# Altium project MB1801.PrjPCB (part 1 of 2)
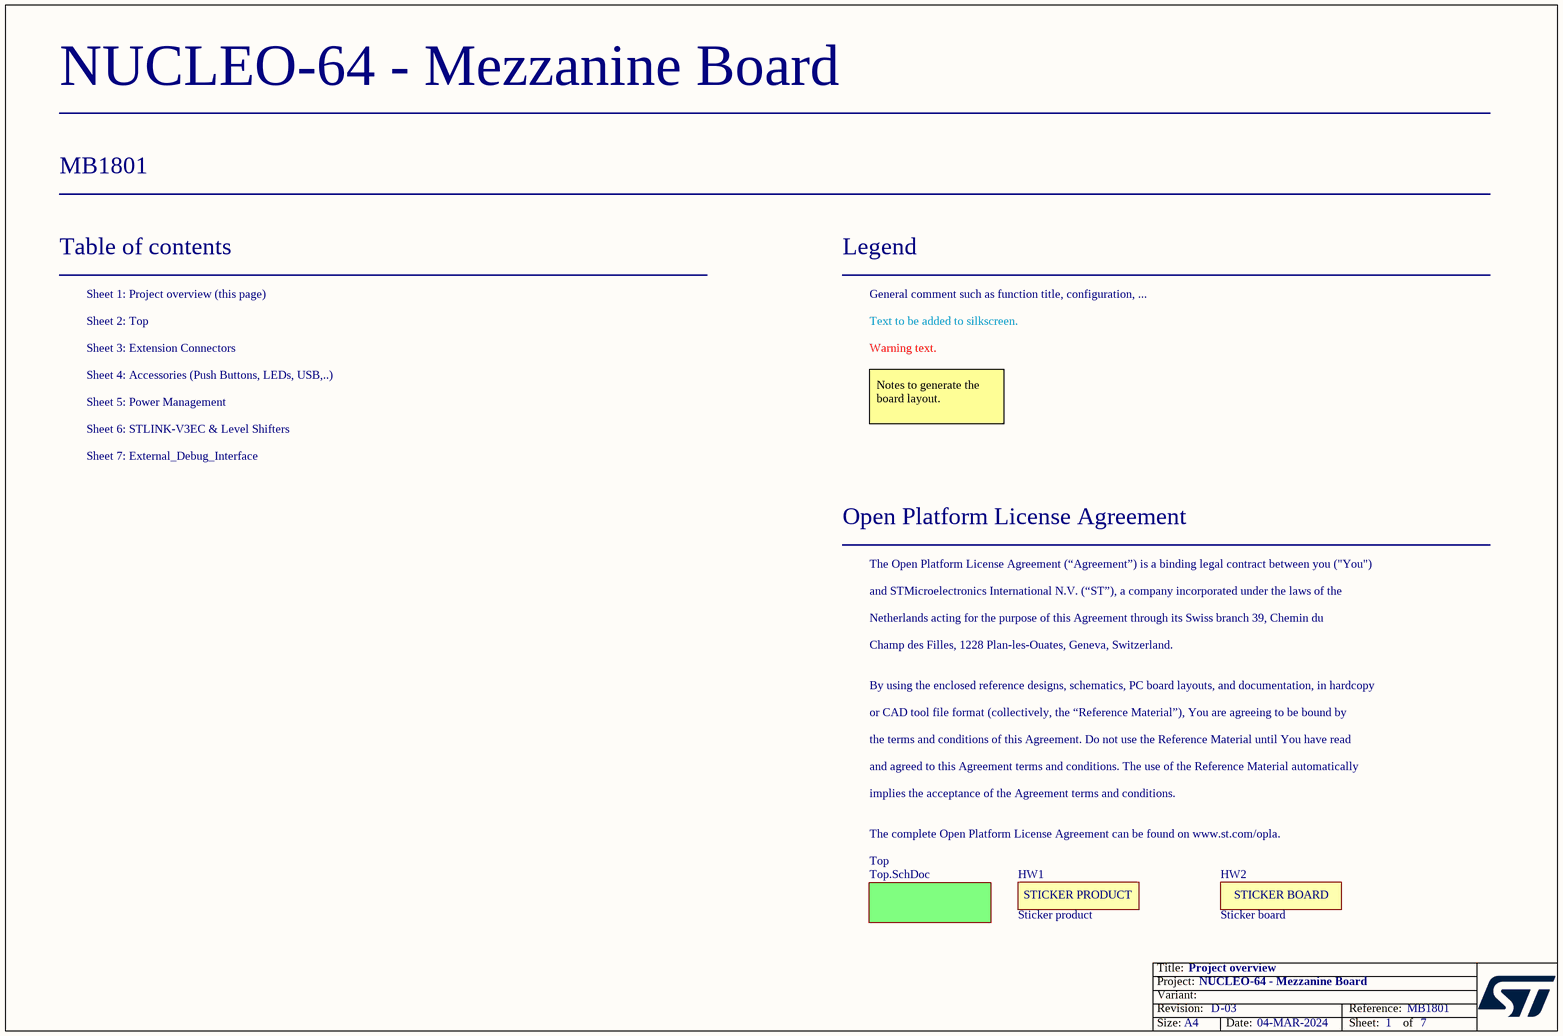
[diagram p0: Project_Overview.SchDoc]
Board_Reference: MB1801; Board_PCB_Revision: D; Board_Name: NUCLEO-64 - Mezzanine Board; Board_Document_Date: 04-MAR-2024; Board_Assembly_Revision: 03
7 sheets, 213 parts. Net scope: flat (ports and power ports of the same name join across sheets).
Board file: MB1801.PcbDoc
Sheets:
  Project_Overview.SchDoc
    Top = Top.SchDoc
      Extension Connectors = Extension_CN.SchDoc
      LEDs & Push Buttons & USB-C Connector = Accessories.SchDoc
      Power Management = Power_Management.SchDoc
      U_STlink-V3EC = STlink-V3EC.SchDoc
      U_External_Debug_Interface = External_Debug_Interface.SchDoc

## Sheet Project_Overview.SchDoc: Project overview
size A4; Date: Not used; ApprovedBy: Not used; CheckedBy: Not used; Author: Not used; CompanyName: STMicroelectronics; DrawnBy: Not used; Engineer: Not used; Organization: Not used; Address1: Not used; Address2: Not used; Address3: Not used; Address4: Not used; DocumentNumber: Not used; Revision: Not used; SheetNumber: 1; SheetTotal: 7; CurrentTime: Not used; CurrentDate: Not used; Time: Not used; DocumentFullPathAndName: Not used; DocumentName: Not used; ModifiedDate: Not used; ImagePath: Not used; ProjectName: Not used; Application_BuildNumber: Not used

### Parts
HW1  value Sticker product  [STICKER_PRODUCT_25X5]  (hidden comment: STICKER_PRODUCT)  (no BOM)
HW2  value Sticker board  [STICKER_BOARD_25X5]  (hidden comment: STICKER_BOARD)  (no BOM)

### Sub-sheets
Top = Top.SchDoc: no entries

### Notes on the sheet
- Table of contents
- Sheet 1: Project overview (this page)
- Legend
- General comment such as function title, configuration, ...
- Sheet 2: Top
- Sheet 3: Extension Connectors
- Sheet 4: Accessories (Push Buttons, LEDs, USB,..)
- Text to be added to silkscreen.
- Warning text.
- Sheet 6: STLINK-V3EC & Level Shifters
- Sheet 5: Power Management
- Notes to generate the board layout.
- Sheet 7: External_Debug_Interface
- Open Platform License Agreement
- The Open Platform License Agreement (“Agreement”) is a binding legal contract between you ("You")
- and STMicroelectronics International N.V. (“ST”), a company incorporated under the laws of the
- Netherlands acting for the purpose of this Agreement through its Swiss branch 39, Chemin du
- Champ des Filles, 1228 Plan-les-Ouates, Geneva, Switzerland.
- By using the enclosed reference designs, schematics, PC board layouts, and documentation, in hardcopy
- or CAD tool file format (collectively, the “Reference Material”), You are agreeing to be bound by
- the terms and conditions of this Agreement. Do not use the Reference Material until You have read
- and agreed to this Agreement terms and conditions. The use of the Reference Material automatically
- implies the acceptance of the Agreement terms and conditions.
- The complete Open Platform License Agreement can be found on www.st.com/opla.
- Title:
- Project:
- Size:
- Revision:
- Variant:
- A4
- -
- Date:
- Reference:
- Sheet:
- of
- (in symbol MCD-02189) STICKER PRODUCT
- (in symbol MCD-02190) STICKER BOARD

### Library data of the parts
HW1 = MCD-02189: Sticker product 25x5 mm; Part_Type: Misc; Part_Preference: Recommended; Component_Country_Of_Origin: Unknown; ShowFields: YES; ID: 4289; Internal_Part_Number: MCD-02189; Status: Released; Manufacturer: N/A; Manufacturer_Part_Number: N/A; ComponentLink1URL: N/A; Order_Code_Digikey: N/A; Order_Code_Farnell: N/A; Order_Code_RS: N/A
HW2 = MCD-02190: Sticker board 25x5 mm; Part_Type: Misc; Part_Preference: Recommended; Internal_Part_Number: MCD-02190; Status: Released; Manufacturer: N/A; Manufacturer_Part_Number: N/A; ComponentLink1URL: N/A; Order_Code_Digikey: N/A; Order_Code_Farnell: N/A; Order_Code_RS: N/A

## Sheet Top.SchDoc: Top Schematic
size A4; Date: Not used; ApprovedBy: Not used; CheckedBy: Not used; Author: Not used; CompanyName: STMicroelectronics; DrawnBy: Not used; Engineer: Not used; Organization: Not used; Address1: Not used; Address2: Not used; Address3: Not used; Address4: Not used; DocumentNumber: Not used; Revision: Not used; SheetNumber: 2; SheetTotal: 7; CurrentTime: Not used; CurrentDate: Not used; Time: Not used; DocumentFullPathAndName: Not used; DocumentName: Not used; ModifiedDate: Not used; ImagePath: Not used; ProjectName: Not used; Application_BuildNumber: Not used
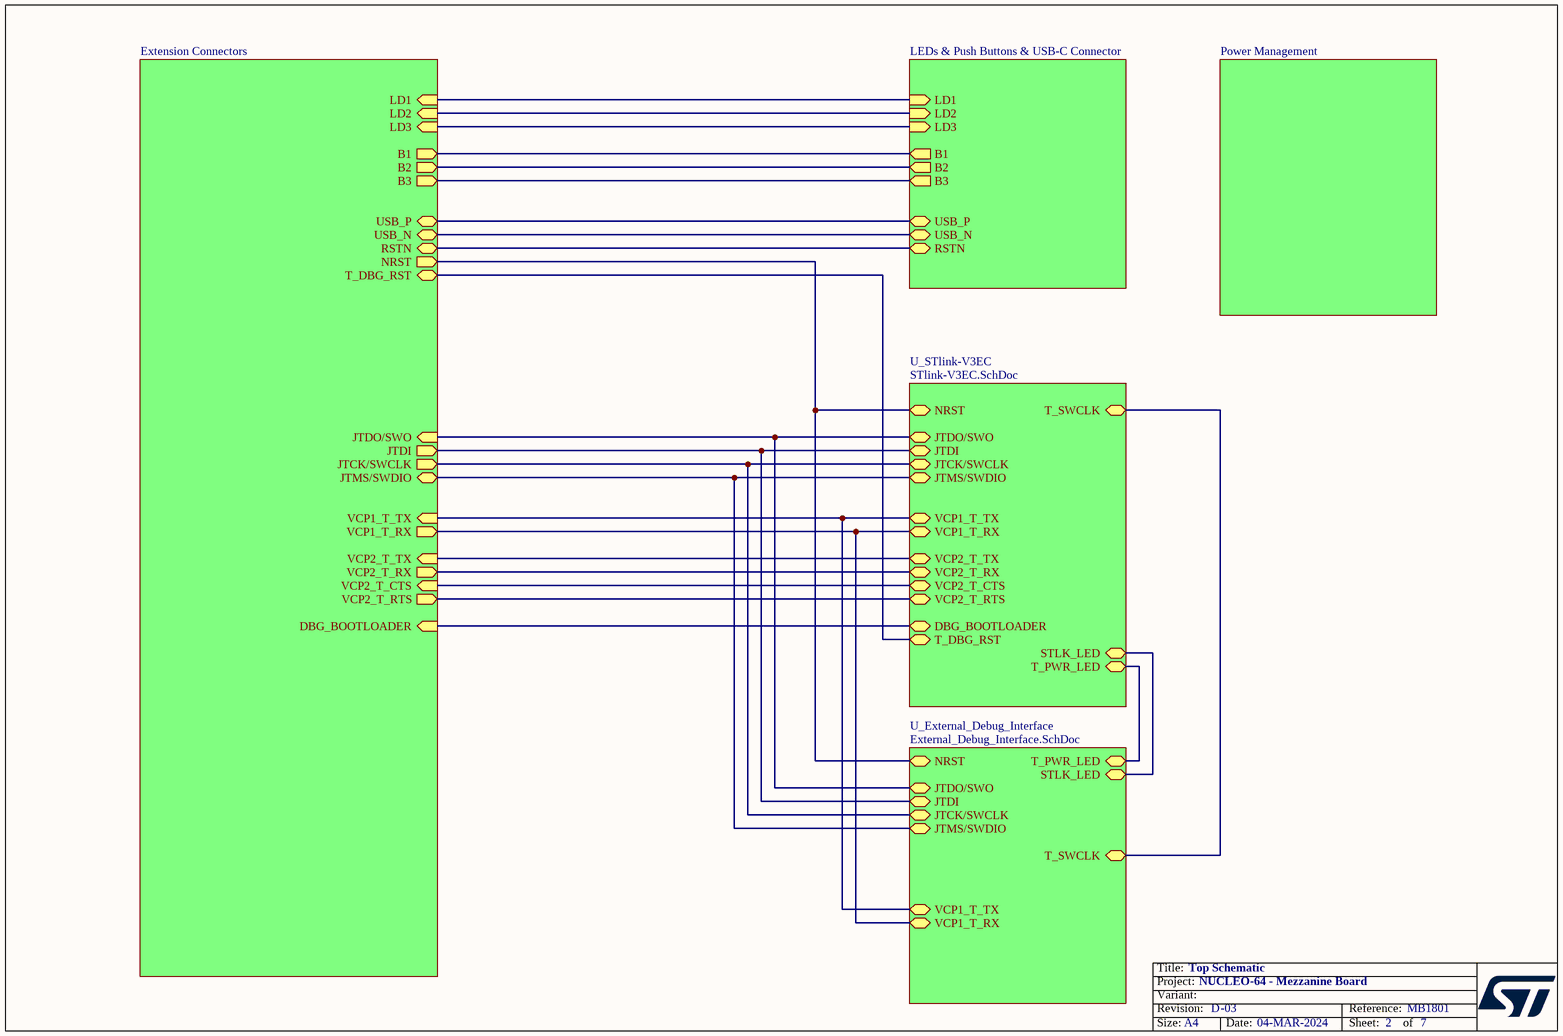
[diagram p1: Top.SchDoc]

### Sub-sheets
Extension Connectors = Extension_CN.SchDoc: JTMS/SWDIO (bidir), USB_P (bidir), USB_N (bidir), NRST (out), LD2 (in), LD3 (in), JTDI (out), B3 (out), B1 (out), JTDO/SWO (in), B2 (out), LD1 (in), DBG_BOOTLOADER (in), VCP1_T_RX (out), VCP2_T_CTS (in), VCP1_T_TX (in), VCP2_T_RX (out), VCP2_T_RTS (out), VCP2_T_TX (in), JTCK/SWCLK (out), T_DBG_RST (bidir), RSTN (bidir)
LEDs & Push Buttons & USB-C Connector = Accessories.SchDoc: LD1 (in), LD2 (in), LD3 (in), B1 (out), B2 (out), B3 (out), USB_P (bidir), USB_N (bidir), RSTN (bidir)
Power Management = Power_Management.SchDoc: no entries
U_External_Debug_Interface = External_Debug_Interface.SchDoc: JTDI (bidir), VCP1_T_TX (bidir), T_SWCLK (bidir), NRST (bidir), VCP1_T_RX (bidir), STLK_LED (bidir), T_PWR_LED (bidir), JTCK/SWCLK (bidir), JTMS/SWDIO (bidir), JTDO/SWO (bidir)
U_STlink-V3EC = STlink-V3EC.SchDoc: JTMS/SWDIO (bidir), JTDI (bidir), JTDO/SWO (bidir), NRST (bidir), DBG_BOOTLOADER (bidir), STLK_LED (bidir), VCP1_T_RX (bidir), VCP1_T_TX (bidir), T_PWR_LED (bidir), VCP2_T_RTS (bidir), VCP2_T_RX (bidir), VCP2_T_TX (bidir), T_SWCLK (bidir), VCP2_T_CTS (bidir), JTCK/SWCLK (bidir), T_DBG_RST (bidir)

### Nets
(unnamed): sheet Extension Connectors/JTMS/SWDIO, sheet U_STlink-V3EC/JTMS/SWDIO, sheet U_External_Debug_Interface/JTMS/SWDIO
(unnamed): sheet Extension Connectors/USB_P, sheet LEDs & Push Buttons & USB-C Connector/USB_P
(unnamed): sheet Extension Connectors/USB_N, sheet LEDs & Push Buttons & USB-C Connector/USB_N
(unnamed): sheet Extension Connectors/NRST, sheet U_STlink-V3EC/NRST, sheet U_External_Debug_Interface/NRST
(unnamed): sheet Extension Connectors/LD2, sheet LEDs & Push Buttons & USB-C Connector/LD2
(unnamed): sheet Extension Connectors/LD3, sheet LEDs & Push Buttons & USB-C Connector/LD3
(unnamed): sheet Extension Connectors/JTDI, sheet U_STlink-V3EC/JTDI, sheet U_External_Debug_Interface/JTDI
(unnamed): sheet Extension Connectors/B3, sheet LEDs & Push Buttons & USB-C Connector/B3
(unnamed): sheet Extension Connectors/B1, sheet LEDs & Push Buttons & USB-C Connector/B1
(unnamed): sheet Extension Connectors/JTDO/SWO, sheet U_STlink-V3EC/JTDO/SWO, sheet U_External_Debug_Interface/JTDO/SWO
(unnamed): sheet Extension Connectors/B2, sheet LEDs & Push Buttons & USB-C Connector/B2
(unnamed): sheet Extension Connectors/LD1, sheet LEDs & Push Buttons & USB-C Connector/LD1
(unnamed): sheet Extension Connectors/DBG_BOOTLOADER, sheet U_STlink-V3EC/DBG_BOOTLOADER
(unnamed): sheet Extension Connectors/VCP1_T_RX, sheet U_STlink-V3EC/VCP1_T_RX, sheet U_External_Debug_Interface/VCP1_T_RX
(unnamed): sheet Extension Connectors/VCP2_T_CTS, sheet U_STlink-V3EC/VCP2_T_CTS
(unnamed): sheet Extension Connectors/VCP1_T_TX, sheet U_STlink-V3EC/VCP1_T_TX, sheet U_External_Debug_Interface/VCP1_T_TX
(unnamed): sheet Extension Connectors/VCP2_T_RX, sheet U_STlink-V3EC/VCP2_T_RX
(unnamed): sheet Extension Connectors/VCP2_T_RTS, sheet U_STlink-V3EC/VCP2_T_RTS
(unnamed): sheet Extension Connectors/VCP2_T_TX, sheet U_STlink-V3EC/VCP2_T_TX
(unnamed): sheet Extension Connectors/JTCK/SWCLK, sheet U_STlink-V3EC/JTCK/SWCLK, sheet U_External_Debug_Interface/JTCK/SWCLK
(unnamed): sheet Extension Connectors/T_DBG_RST, sheet U_STlink-V3EC/T_DBG_RST
(unnamed): sheet Extension Connectors/RSTN, sheet LEDs & Push Buttons & USB-C Connector/RSTN
(unnamed): sheet U_STlink-V3EC/STLK_LED, sheet U_External_Debug_Interface/STLK_LED
(unnamed): sheet U_STlink-V3EC/T_PWR_LED, sheet U_External_Debug_Interface/T_PWR_LED
(unnamed): sheet U_STlink-V3EC/T_SWCLK, sheet U_External_Debug_Interface/T_SWCLK

### Notes on the sheet
- Title:
- Project:
- Size:
- Revision:
- Variant:
- A4
- -
- Date:
- Reference:
- Sheet:
- of

## Sheet Extension_CN.SchDoc: Extension Connectors
size A4; Date: Not used; ApprovedBy: Not used; CheckedBy: Not used; Author: Not used; CompanyName: STMicroelectronics; DrawnBy: Not used; Engineer: Not used; Organization: Not used; Address1: Not used; Address2: Not used; Address3: Not used; Address4: Not used; DocumentNumber: Not used; Revision: Not used; SheetNumber: 3; SheetTotal: 7; CurrentTime: Not used; CurrentDate: Not used; Time: Not used; DocumentFullPathAndName: Not used; DocumentName: Not used; ModifiedDate: Not used; ImagePath: Not used; ProjectName: Not used; Application_BuildNumber: Not used
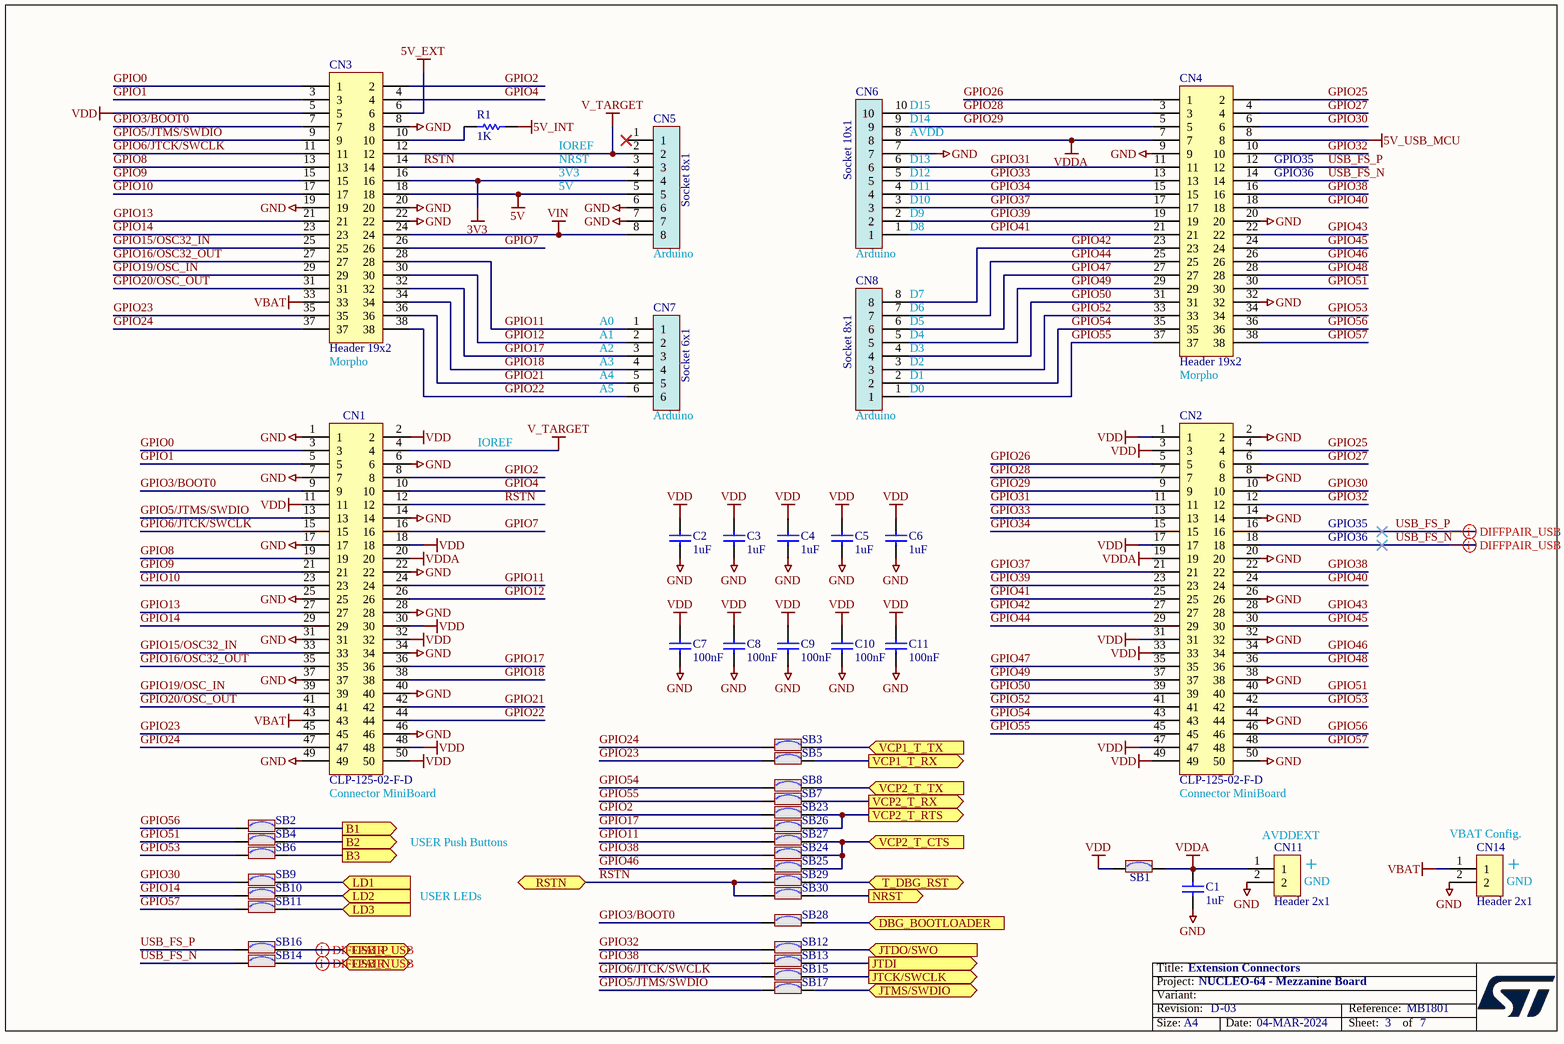
[diagram p2: Extension_CN.SchDoc]

### Parts
C1  value 1uF  [C0805_H0P85]  (hidden comment: Capacitor)
C2  value 1uF  [C0805_H0P85]  (hidden comment: Capacitor)
C3  value 1uF  [C0805_H0P85]  (hidden comment: Capacitor)
C4  value 1uF  [C0805_H0P85]  (hidden comment: Capacitor)
C5  value 1uF  [C0805_H0P85]  (hidden comment: Capacitor)
C6  value 1uF  [C0805_H0P85]  (hidden comment: Capacitor)
C7  value 100nF  [C0402]  (hidden comment: Capacitor)
C8  value 100nF  [C0402]  (hidden comment: Capacitor)
C9  value 100nF  [C0402]  (hidden comment: Capacitor)
C10  value 100nF  [C0402]  (hidden comment: Capacitor)
C11  value 100nF  [C0402]  (hidden comment: Capacitor)
CN1  CLP-125-02-F-D  [CON_SAMTEC_CLP-125-02-F-D]
CN2  CLP-125-02-F-D  [CON_SAMTEC_CLP-125-02-F-D]
CN3  Header 19x2  [CON_SAMTEC_TSW-119-09-X-D]
CN4  Header 19x2  [CON_SAMTEC_TSW-119-09-X-D]
CN5  Socket 8x1  [CON_SAMTEC_SSW-108-01-X-S]
CN6  Socket 10x1  [CON_SAMTEC_SSW-110-01-X-S]
CN7  Socket 6x1  [CON_SAMTEC_SSW-106-01-X-S]
CN8  Socket 8x1  [CON_SAMTEC_SSW-108-01-X-S]
CN11  Header 2x1  [CON_SAMTEC_TSW-102-07-G-S]
CN14  Header 2x1  [CON_SAMTEC_TSW-102-07-G-S]
R1  value 1K  [R0402]  (hidden comment: Resistor)
SB1  SB_ON  [SOLDER-BRIDGE_R0402-0R]  (value not drawn)
SB2  SB_ON  [SOLDER-BRIDGE_R0402-0R]  (value not drawn)
SB3  SB_ON  [SOLDER-BRIDGE_R0402-0R]  (value not drawn)
SB4  SB_ON  [SOLDER-BRIDGE_R0402-0R]  (value not drawn)
SB5  SB_ON  [SOLDER-BRIDGE_R0402-0R]  (value not drawn)
SB6  SB_ON  [SOLDER-BRIDGE_R0402-0R]  (value not drawn)
SB7  SB_ON  [SOLDER-BRIDGE_R0402-0R]  (value not drawn)
SB8  SB_ON  [SOLDER-BRIDGE_R0402-0R]  (value not drawn)
SB9  SB_ON  [SOLDER-BRIDGE_R0402-0R]  (value not drawn)
SB10  SB_ON  [SOLDER-BRIDGE_R0402-0R]  (value not drawn)
SB11  SB_ON  [SOLDER-BRIDGE_R0402-0R]  (value not drawn)
SB12  SB_ON  [SOLDER-BRIDGE_R0402-0R]  (value not drawn)
SB13  SB_ON  [SOLDER-BRIDGE_R0402-0R]  (value not drawn)
SB14  SB_ON  [SOLDER-BRIDGE_R0402-0R]  (value not drawn)
SB15  SB_ON  [SOLDER-BRIDGE_R0402-0R]  (value not drawn)
SB16  SB_ON  [SOLDER-BRIDGE_R0402-0R]  (value not drawn)
SB17  SB_ON  [SOLDER-BRIDGE_R0402-0R]  (value not drawn)
SB23  SB_ON  [SOLDER-BRIDGE_R0402-0R]  (value not drawn)
SB24  SB_ON  [SOLDER-BRIDGE_R0402-0R]  (value not drawn)
SB25  SB_ON  [SOLDER-BRIDGE_R0402-0R]  (value not drawn)
SB26  SB_ON  [SOLDER-BRIDGE_R0402-0R]  (value not drawn)
SB27  SB_ON  [SOLDER-BRIDGE_R0402-0R]  (value not drawn)
SB28  SB_ON  [SOLDER-BRIDGE_R0402-0R]  (value not drawn)
SB29  SB_ON  [SOLDER-BRIDGE_R0402-0R]  (value not drawn)
SB30  SB_ON  [SOLDER-BRIDGE_R0402-0R]  (value not drawn)

### Ports
B1 (out), B2 (out), B3 (out), DBG_BOOTLOADER (in), JTCK/SWCLK (out), JTDI (out), JTDO/SWO (in), JTMS/SWDIO (bidir), LD1 (in), LD2 (in), LD3 (in), NRST (out), RSTN (bidir), T_DBG_RST (bidir), USB_N (bidir), USB_P (bidir), VCP1_T_RX (out), VCP1_T_TX (in), VCP2_T_CTS (in), VCP2_T_RTS (out), VCP2_T_RX (out), VCP2_T_TX (in)

### Nets
3V3: CN3.16 CN5.4
5V: CN3.18 CN5.5
5V_EXT: CN3.6
5V_INT: R1.2
5V_USB_MCU: CN4.8
GND: C1.1 C2.1 C3.1 C4.1 C5.1 C6.1 C7.1 C8.1 C9.1 C10.1 C11.1 CN1.1 CN1.6 CN1.7 CN1.14 CN1.17 CN1.22 CN1.25 CN1.28 CN1.31 CN1.34 CN1.37 CN1.40 CN1.46 CN1.49 CN2.2 CN2.8 CN2.14 CN2.20 CN2.26 CN2.32 CN2.38 CN2.44 CN2.50 CN3.8 CN3.19 CN3.20 CN3.22 CN4.9 CN4.20 CN4.32 CN5.6 CN5.7 CN6.7 CN11.2 CN14.2
V_TARGET: CN1.4 CN3.12 CN5.2
VBAT: CN1.43 CN3.33 CN14.1
VDD: C2.2 C3.2 C4.2 C5.2 C6.2 C7.2 C8.2 C9.2 C10.2 C11.2 CN1.2 CN1.11 CN1.18 CN1.30 CN1.32 CN1.48 CN1.50 CN2.1 CN2.3 CN2.17 CN2.31 CN2.33 CN2.47 CN2.49 CN3.5 SB1.1
VDDA: C1.2 CN1.20 CN2.19 CN4.7 CN6.8 CN11.1 SB1.2
VIN: CN3.24 CN5.8
B1: SB2.2 ; port B1
B2: SB4.2 ; port B2
B3: SB6.2 ; port B3
DBG_BOOTLOADER: SB28.2 ; port DBG_BOOTLOADER
GPIO0: CN1.3 CN3.1
GPIO1: CN1.5 CN3.3
GPIO2: CN1.8 CN3.2 SB23.1
GPIO3/BOOT0: CN1.9 CN3.7 SB28.1
GPIO4: CN1.10 CN3.4
GPIO5/JTMS/SWDIO: CN1.13 CN3.9 SB17.1
GPIO6/JTCK/SWCLK: CN1.15 CN3.11 SB15.1
GPIO7: CN1.16 CN3.26
GPIO8: CN1.19 CN3.13
GPIO9: CN1.21 CN3.15
GPIO10: CN1.23 CN3.17
GPIO11: CN1.24 CN3.28 CN7.1 SB27.1
GPIO12: CN1.26 CN3.30 CN7.2
GPIO13: CN1.27 CN3.21
GPIO14: CN1.29 CN3.23 SB10.1
GPIO15/OSC32_IN: CN1.33 CN3.25
GPIO16/OSC32_OUT: CN1.35 CN3.27
GPIO17: CN1.36 CN3.32 CN7.3 SB26.1
GPIO18: CN1.38 CN3.34 CN7.4
GPIO19/OSC_IN: CN1.39 CN3.29
GPIO20/OSC_OUT: CN1.41 CN3.31
GPIO21: CN1.42 CN3.36 CN7.5
GPIO22: CN1.44 CN3.38 CN7.6
GPIO23: CN1.45 CN3.35 SB5.1
GPIO24: CN1.47 CN3.37 SB3.1
GPIO25: CN2.4 CN4.2
GPIO26: CN2.5 CN4.1
GPIO27: CN2.6 CN4.4
GPIO28: CN2.7 CN4.3 CN6.10
GPIO29: CN2.9 CN4.5 CN6.9
GPIO30: CN2.10 CN4.6 SB9.1
GPIO31: CN2.11 CN4.11 CN6.6
GPIO32: CN2.12 CN4.10 SB12.1
GPIO33: CN2.13 CN4.13 CN6.5
GPIO34: CN2.15 CN4.15 CN6.4
GPIO37: CN2.21 CN4.17 CN6.3
GPIO38: CN2.22 CN4.16 SB13.1 SB24.1
GPIO39: CN2.23 CN4.19 CN6.2
GPIO40: CN2.24 CN4.18
GPIO41: CN2.25 CN4.21 CN6.1
GPIO42: CN2.27 CN4.23 CN8.8
GPIO43: CN2.28 CN4.22
GPIO44: CN2.29 CN4.25 CN8.7
GPIO45: CN2.30 CN4.24
GPIO46: CN2.34 CN4.26 SB25.1
GPIO47: CN2.35 CN4.27 CN8.6
GPIO48: CN2.36 CN4.28
GPIO49: CN2.37 CN4.29 CN8.5
GPIO50: CN2.39 CN4.31 CN8.4
GPIO51: CN2.40 CN4.30 SB4.1
GPIO52: CN2.41 CN4.33 CN8.3
GPIO53: CN2.42 CN4.34 SB6.1
GPIO54: CN2.43 CN4.35 CN8.2 SB8.1
GPIO55: CN2.45 CN4.37 CN8.1 SB7.1
GPIO56: CN2.46 CN4.36 SB2.1
GPIO57: CN2.48 CN4.38 SB11.1
JTCK/SWCLK: SB15.2 ; port JTCK/SWCLK
JTDI: SB13.2 ; port JTDI
JTDO/SWO: SB12.2 ; port JTDO/SWO
JTMS/SWDIO: SB17.2 ; port JTMS/SWDIO
LD1: SB9.2 ; port LD1
LD2: SB10.2 ; port LD2
LD3: SB11.2 ; port LD3
NRST: SB30.2 ; port NRST
RSTN: CN1.12 CN3.14 CN5.3 SB29.1 SB30.1 ; port RSTN
T_DBG_RST: SB29.2 ; port T_DBG_RST
USB_FS_N: CN2.18 CN4.14 SB14.1
USB_FS_P: CN2.16 CN4.12 SB16.1
USB_N: SB14.2 ; port USB_N
USB_P: SB16.2 ; port USB_P
VCP1_T_RX: SB5.2 ; port VCP1_T_RX
VCP1_T_TX: SB3.2 ; port VCP1_T_TX
VCP2_T_CTS: SB24.2 SB25.2 SB27.2 ; port VCP2_T_CTS
VCP2_T_RTS: SB23.2 SB26.2 ; port VCP2_T_RTS
VCP2_T_RX: SB7.2 ; port VCP2_T_RX
VCP2_T_TX: SB8.2 ; port VCP2_T_TX
NetCN3_10: CN3.10 R1.1

Not connected (* = marked no-connect by the designer): CN5 1*

### Layout directives
differential pair; rule Impedance Constraint [Min = 85.00    Max = 95.00    ]: USB_FS_N, USB_FS_P, USB_N, USB_P

### Notes on the sheet
- (near CN6) D15
- IOREF
- NRST
- 3V3
- (near CN6) D12
- (near CN6) D13
- (near CN6) D14
- (near CN6) AVDD
- (near CN4) GPIO35
- (near CN4) GPIO36
- 5V
- (near CN6) D8
- (near CN6) D9
- (near CN6) D10
- (near CN6) D11
- (near CN5) Arduino
- (near CN6) Arduino
- (near CN8) D6
- (near CN8) D7
- (near CN3) Morpho
- (near CN7) A0
- (near CN7) A1
- (near CN7) A2
- (near CN7) A3
- (near CN7) A4
- (near CN8) D1
- (near CN8) D2
- (near CN8) D3
- (near CN8) D4
- (near CN8) D5
- (near CN4) Morpho
- (near CN7) A5
- (near CN7) Arduino
- (near CN8) Arduino
- (near CN8) D0
- GPIO35
- GPIO36
- (near CN1) Connector MiniBoard
- USER Push Buttons
- (near CN2) Connector MiniBoard
- (near CN11) AVDDEXT
- (near CN14) VBAT Config.
- USER LEDs
- (near CN11) GND
- (near CN11) +
- (near CN14) GND
- (near CN14) +
- Title:
- Project:
- Size:
- Revision:
- Variant:
- -
- Date:
- Reference:
- Sheet:
- of

### Library data of the parts
C1-C6 = MCD-01550: Capacitor, MLCC, 1uF, 16V, X5R, +/-10%, 0805, T=0.85mm; Manufacturer_Part_Number: CC0805KRX5R7BB105; Manufacturer: YAGEO; Part_Preference: Recommended; Component_Country_Of_Origin: China; Internal_Part_Number: MCD-01550; Status: Released; Part_Type: Capacitor; Package: 0805; ComponentLink1URL: http://tunmcdsvn.tun.st.com/Component_Documentation_Library/Trunk/Capacitor/YAGEO_X5R_Series; Order_Code_Digikey: 311-3427-1-ND; Order_Code_Farnell: N/A; Order_Code_RS: N/A
C7-C11 = MCD-02355: Capacitor, MLCC, 100nF, 25V, X7R, +/-10%, 0402, T=0.5mm; Part_Preference: Recommended; Manufacturer: WALSIN; Manufacturer_Part_Number: 0402B104K250CT; Order_Code_RS: 176-3114; Component_Country_Of_Origin: Unknown; Internal_Part_Number: MCD-02355; Status: Checked; Part_Type: Capacitor; Package: 0402; ComponentLink1URL: http://tunmcdsvn.tun.st.com/Component_Documentation_Library/Trunk/Capacitor/WALSIN_Monolithic_Series/; Order_Code_Digikey: 1292-1175-1-ND; Order_Code_Farnell: 2496772
CN1 CN2 = MCD-02705: Socket, 25x2, 1.27mm, VR, SMD, T=2.29mm; Part_Type: Connector; Part_Preference: Recommended; Manufacturer: SAMTEC; Value: Socket 25x2; Order_Code_RS: 180-3642; Component_Country_Of_Origin: USA; ShowFields: YES; ID: 4811; Order_Code_Digikey: SAM1153-25-ND; Order_Code_Farnell: 2779411; Status: Checked; ComponentLink1URL: http://tunmcdsvn.tun.st.com/Component_Documentation_Library/Trunk/Connector/SAMTEC_CLP_Series; Internal_Part_Number: MCD-02705; Manufacturer_Part_Number: CLP-125-02-F-D
CN3 CN4 = MCD-00213: Header, 19x2, 2.54mm, VR, TH, T=5.84mm/10.16mm; Part_Type: Connector; Part_Preference: Recommended; Manufacturer: SAMTEC; Manufacturer_Part_Number: TSW-119-09-G-D; Component_Country_Of_Origin: China, Costa Rica, Malaysia, United States, Vietnam; Internal_Part_Number: MCD-00213; Value: Header 19x2; Status: Released; ComponentLink1URL: http://tunmcdsvn.tun.st.com/Component_Documentation_Library/Trunk/Connector/SAMTEC_TSW_Series/; Order_Code_Digikey: TSW-119-09-G-D-ND; Order_Code_Farnell: 3664236; Order_Code_RS: N/A
CN5 CN8 = MCD-01743: Socket, 8x1, 2.54mm, VR, TH, T=8.51/2.64mm; Part_Type: Connector; Part_Preference: Recommended; Manufacturer: SAMTEC; Manufacturer_Part_Number: SSW-108-01-G-S; Order_Code_RS: 765-5698; Component_Country_Of_Origin: China, Costa Rica, Malaysia, United States, Vietnam; Internal_Part_Number: MCD-01743; Value: Socket 8x1; Status: Released; ComponentLink1URL: http://tunmcdsvn.tun.st.com/Component_Documentation_Library/Trunk/Connector/SAMTEC_SSW-SSQ(TH)_Series/; Order_Code_Digikey: SAM1209-08-ND; Order_Code_Farnell: 1668363
CN6 = MCD-02080: Socket, 10x1, 2.54mm, VR, TH, T=8.51/2.64mm; Part_Type: Connector; Part_Preference: Recommended; Manufacturer: SAMTEC; Manufacturer_Part_Number: SSW-110-01-G-S; Order_Code_RS: 765-5736; Component_Country_Of_Origin: China, Costa Rica, Malaysia, United States, Vietnam; Internal_Part_Number: MCD-02080; Value: Socket 10x1; Status: Checked; ComponentLink1URL: http://tunmcdsvn.tun.st.com/Component_Documentation_Library/Trunk/Connector/SAMTEC_SSW-SSQ(TH)_Series/; Order_Code_Digikey: SSW-110-01-G-S-LL-ND; Order_Code_Farnell: 1668374
CN7 = MCD-02079: Socket, 6x1, 2.54mm, VR, TH, T=8.51/2.64mm; Part_Type: Connector; Part_Preference: Recommended; Manufacturer: SAMTEC; Manufacturer_Part_Number: SSW-106-01-G-S; Order_Code_RS: 765-5666; Component_Country_Of_Origin: China, Costa Rica, Malaysia, United States, Vietnam; Internal_Part_Number: MCD-02079; Value: Socket 6x1; Status: Checked; ComponentLink1URL: http://tunmcdsvn.tun.st.com/Component_Documentation_Library/Trunk/Connector/SAMTEC_SSW-SSQ(TH)_Series/; Order_Code_Digikey: SSW-106-01-G-S-LL-ND; Order_Code_Farnell: 1668352
CN11 CN14 = MCD-00032: Header, 2x1, 2.54mm, VR, TH, T=5.84mm/2.54mm; Part_Type: Connector; Part_Preference: Recommended; Manufacturer: SAMTEC; Manufacturer_Part_Number: TSW-102-07-G-S; Order_Code_RS: 155-5312; Component_Country_Of_Origin: China, Costa Rica, Malaysia, United States, Vietnam; Internal_Part_Number: MCD-00032; Value: Header 2x1; Status: Released; ComponentLink1URL: http://tunmcdsvn.tun.st.com/Component_Documentation_Library/Trunk/Connector/SAMTEC_TSW_Series/; Order_Code_Digikey: SAM1029-02-ND; Order_Code_Farnell: 2505044
R1 = MCD-00061: Resistor, 1K, 0402, +/-1%,1/16W; Part_Preference: Recommended; Manufacturer: YAGEO; Manufacturer_Part_Number: RC0402FR-071KL; Component_Country_Of_Origin: China; Internal_Part_Number: MCD-00061; Status: Released; Part_Type: Resistor; Package: 0402; ComponentLink1URL: http://tunmcdsvn.tun.st.com/Component_Documentation_Library/Trunk/Resistor/YAGEO_RC_L_Series; Order_Code_Digikey: 311-1.00KLRCT-ND; Order_Code_Farnell: 9239235; Order_Code_RS: N/A
SB1-SB17 SB23-SB30 = MCD-01618: Solder Bridge 0402 ON; Part_Type: Misc; Part_Preference: Recommended; Manufacturer: YAGEO; Manufacturer_Part_Number: RC0402JR-070RL; Order_Code_RS: 618-5804; Component_Country_Of_Origin: China; Internal_Part_Number: MCD-01618; Status: Released; Package: SB0402; ComponentLink1URL: http://tunmcdsvn.tun.st.com/Component_Datasheet_Library/Trunk/Resistors/Yageo_Resistor_RC0402-series; Order_Code_Digikey: 311-0.0JRTR-ND; Order_Code_Farnell: 2363467

## Sheet Accessories.SchDoc: LEDs & Push Buttons & USB-C Connector
size A4; Date: Not used; ApprovedBy: Not used; CheckedBy: Not used; Author: Not used; CompanyName: STMicroelectronics; DrawnBy: Not used; Engineer: Not used; Organization: Not used; Address1: Not used; Address2: Not used; Address3: Not used; Address4: Not used; DocumentNumber: Not used; Revision: Not used; SheetNumber: 4; SheetTotal: 7; CurrentTime: Not used; CurrentDate: Not used; Time: Not used; DocumentFullPathAndName: Not used; DocumentName: Not used; ModifiedDate: Not used; ImagePath: Not used; ProjectName: Not used; Application_BuildNumber: Not used
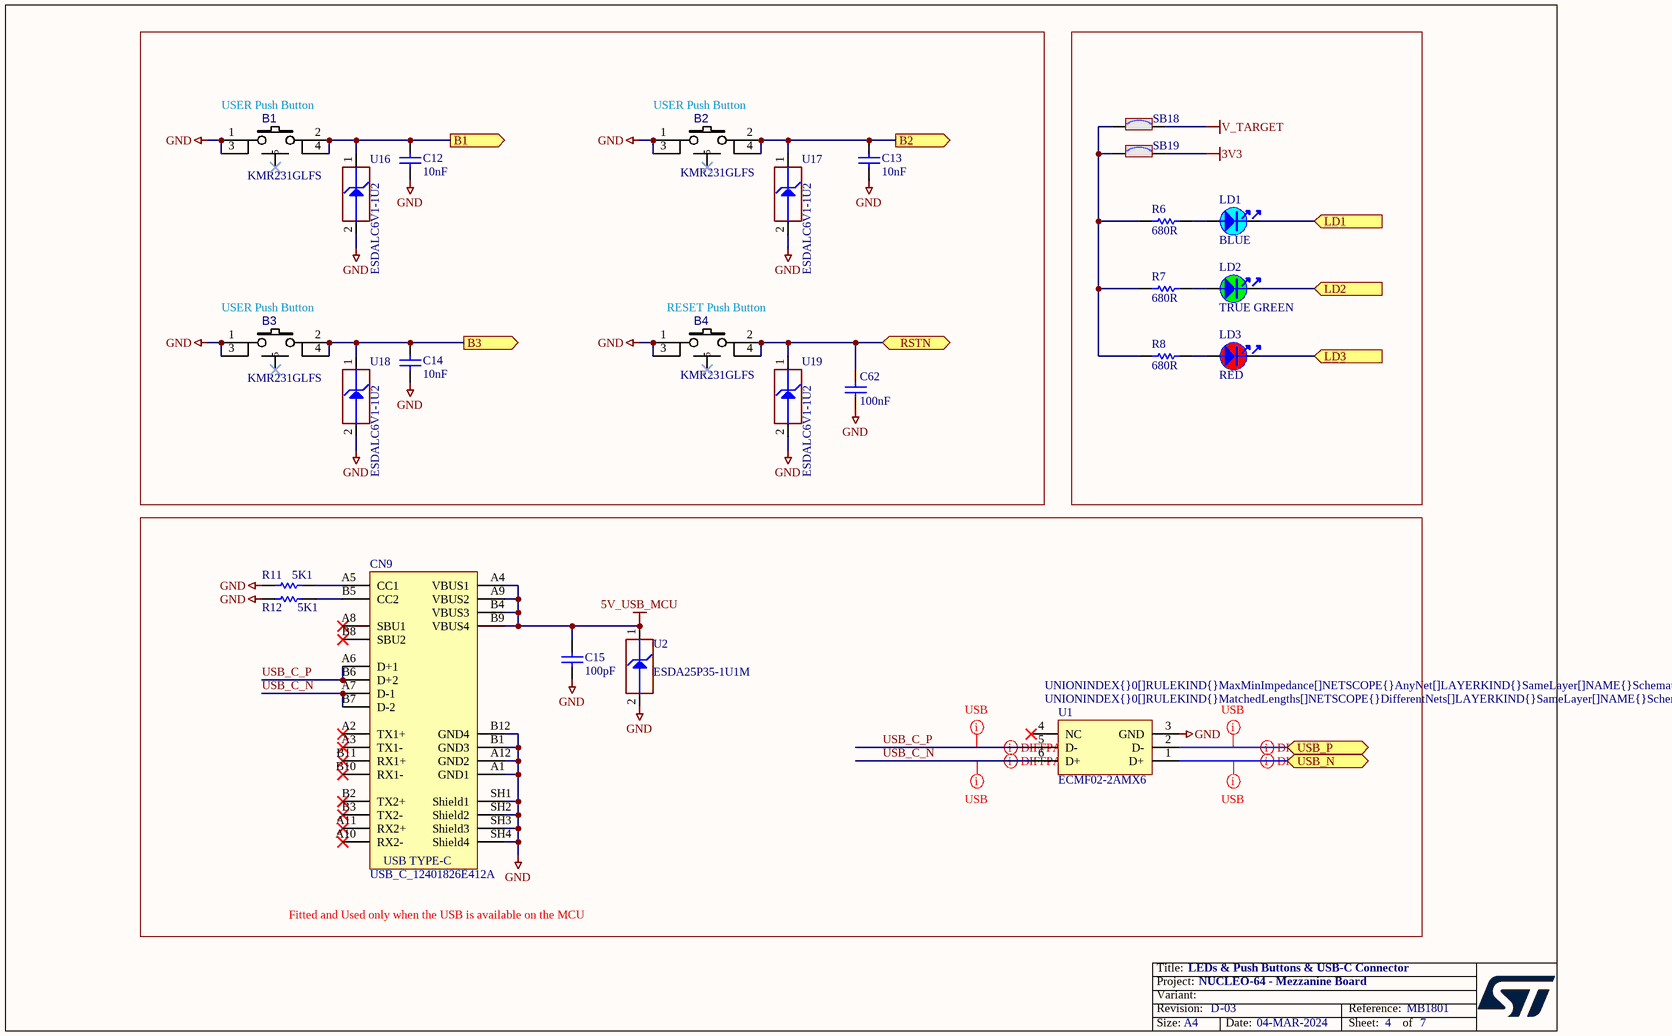
[diagram p3: Accessories.SchDoc]

### Parts
B1  value KMR231GLFS  [SWI_C&K_Y78B23110FP__ITT_KMR231GLFS]  (hidden comment: SW-PUSH-CMS_KMR2_BLACK)
B2  value KMR231GLFS  [SWI_C&K_Y78B23110FP__ITT_KMR231GLFS]  (hidden comment: SW-PUSH-CMS_KMR2_BLACK)
B3  value KMR231GLFS  [SWI_C&K_Y78B23110FP__ITT_KMR231GLFS]  (hidden comment: SW-PUSH-CMS_KMR2_BLACK)
B4  value KMR231GLFS  [SWI_C&K_Y78B23110FP__ITT_KMR231GLFS]  (hidden comment: SW-PUSH-CMS_KMR2_BLACK)
C12  value 10nF  [C0402]  (hidden comment: Capacitor)
C13  value 10nF  [C0402]  (hidden comment: Capacitor)
C14  value 10nF  [C0402]  (hidden comment: Capacitor)
C15  value 100pF  [C0402]  (hidden comment: Capacitor)
C62  value 100nF  [C0402]  (hidden comment: Capacitor)
CN9  value USB_C_12401826E412A  [CON_USB-TYPEC_AMPHENOL_12401826E412A]  (hidden comment: USB_TYPE_C_Receptacle)
LD1  value BLUE  [LED_0603_VISHAY_VLMB1300-GS08_BLUE_1A2K_H0P8]  (hidden comment: LED_blue)
LD2  value TRUE GREEN  [LED_0603_VISHAY_VLMTG1300-GS08_GREEN_1A2K_H0P8]  (hidden comment: LED_green)
LD3  value RED  [LED_0603_VISHAY_VLMS1300-GS08_RED_1A2K_H0P8]  (hidden comment: LED_red)
R6  value 680R  [R0402]  (hidden comment: Resistor)
R7  value 680R  [R0402]  (hidden comment: Resistor)
R8  value 680R  [R0402]  (hidden comment: Resistor)
R11  value 5K1  [R0402]  (hidden comment: Resistor)
R12  value 5K1  [R0402]  (hidden comment: Resistor)
SB18  SB_ON  [SOLDER-BRIDGE_R0402-0R]  (value not drawn)
SB19  SB_ON  [SOLDER-BRIDGE_R0402-0R]  (value not drawn)
U1  ECMF02-2AMX6  [ESD_QFN-6L_1P7X1P5_P050]
U2  value ESDA25P35-1U1M  [ESD_QFN1610_2N_1K_2A]  (hidden comment: ESD-TRANSIL)
U16  value ESDALC6V1-1U2  [ESD_ST0201]  (hidden comment: ESD-TRANSIL)
U17  value ESDALC6V1-1U2  [ESD_ST0201]  (hidden comment: ESD-TRANSIL)
U18  value ESDALC6V1-1U2  [ESD_ST0201]  (hidden comment: ESD-TRANSIL)
U19  value ESDALC6V1-1U2  [ESD_ST0201]  (hidden comment: ESD-TRANSIL)

### Blocks framed on the sheet
Fitted and Used only when the USB is available on the MCU: C15 CN9 R11 R12 U1 U2

### Ports
B1 (out), B2 (out), B3 (out), LD1 (in), LD2 (in), LD3 (in), RSTN (bidir), USB_N (bidir), USB_P (bidir)

### Nets
3V3: SB19.2
5V_USB_MCU: C15.2 CN9.A4(VBUS1) CN9.A9(VBUS2) CN9.B4(VBUS3) CN9.B9(VBUS4) U2.1(IO1)
GND: B1.1 B1.3 B2.1 B2.3 B3.1 B3.3 B4.1 B4.3 C12.1 C13.1 C14.1 C15.1 C62.2 CN9.A1(GND1) CN9.A12(GND2) CN9.B1(GND3) CN9.B12(GND4) CN9.SH1(Shield1) CN9.SH2(Shield2) CN9.SH3(Shield3) CN9.SH4(Shield4) R11.1 R12.1 U1.3(GND) U2.2(GND) U16.2(GND) U17.2(GND) U18.2(GND) U19.2(GND)
V_TARGET: SB18.2
B1: B1.2 B1.4 C12.2 U16.1(IO1) ; port B1
B2: B2.2 B2.4 C13.2 U17.1(IO1) ; port B2
B3: B3.2 B3.4 C14.2 U18.1(IO1) ; port B3
LD1: LD1.2 ; port LD1
LD2: LD2.2 ; port LD2
LD3: LD3.2 ; port LD3
RSTN: B4.2 B4.4 C62.1 U19.1(IO1) ; port RSTN
USB_C_N: CN9.A7(D-1) CN9.B7(D-2) U1.6(D+)
USB_C_P: CN9.A6(D+1) CN9.B6(D+2) U1.5(D-)
USB_N: U1.1(D+) ; port USB_N
USB_P: U1.2(D-) ; port USB_P
NetCN9_A5: CN9.A5(CC1) R11.2
NetCN9_B5: CN9.B5(CC2) R12.2
NetLD1_1: LD1.1 R6.2
NetLD2_1: LD2.1 R7.2
NetLD3_1: LD3.1 R8.2
NetR6_1: R6.1 R7.1 R8.1 SB18.1 SB19.1

Not connected (* = marked no-connect by the designer): B1 5*; B2 5*; B3 5*; B4 5*; CN9 A2(TX1+)* A3(TX1-)* A8(SBU1)* A10(RX2-)* A11(RX2+)* B2(TX2+)* B3(TX2-)* B8(SBU2)* B10(RX1-)* B11(RX1+)*; U1 4(NC)*

### Layout directives
differential pair; rule Impedance Constraint [Min = 85.00    Max = 95.00    ]: USB_C_N, USB_C_P, USB_N, USB_P
rule Undefined; rule Matched Net Lengths [Tolerance = 2mm]; rule Impedance Constraint [Min = 85.00    Max = 95.00    ]: USB_C_N, USB_C_P, USB_N, USB_P

### Notes on the sheet
- (near B1) USER Push Button
- (near B2) USER Push Button
- (near B3) USER Push Button
- (near B4) RESET Push Button
- Title:
- Project:
- Size:
- Revision:
- Variant:
- A4
- -
- Date:
- Reference:
- Sheet:
- of
- (in symbol MCD-03232) USB TYPE-C

### Library data of the parts
B1-B4 = MCD-01485: Microminiature Tact Switch for SMT - KMR 2 Series - 1.9 mm height; Part_Type: Misc; Manufacturer: C&K; Part_Preference: Recommended; Component_Country_Of_Origin: France; Internal_Part_Number: MCD-01485; Status: Released; Manufacturer_Part_Number: KMR231GLFS; ComponentLink1URL: http://tunmcdsvn.tun.st.com/Component_Datasheet_Library/Trunk/Misc/C&K_tactile_switch_KMR_series
C12-C14 = MCD-02198: Capacitor, MLCC, 10nF, 50V, X7R, +/-10%, 0402, T=0.5mm; Part_Preference: Recommended; Manufacturer: YAGEO; Manufacturer_Part_Number: CC0402KRX7R9BB103; Order_Code_RS: 6169644; Component_Country_Of_Origin: China; Internal_Part_Number: MCD-02198; Status: Checked; Part_Type: Capacitor; Package: 0402; ComponentLink1URL: http://tunmcdsvn.tun.st.com/Component_Documentation_Library/Trunk/Capacitor/YAGEO_X7R_Series; Order_Code_Digikey: N/A; Order_Code_Farnell: N/A
C15 = MCD-00205: Capacitor, MLCC, 100pF, 50V, NPO, +/-5%, 0402, T=0.5mm; Manufacturer_Part_Number: CC0402JRNPO9BN101; Manufacturer: YAGEO; Part_Preference: Recommended; Component_Country_Of_Origin: China; Internal_Part_Number: MCD-00205; Status: Released; Part_Type: Capacitor; Package: 0402; ComponentLink1URL: http://tunmcdsvn.tun.st.com/Component_Documentation_Library/Trunk/Capacitor/YAGEO_NP0_Series; Order_Code_Digikey: 311-1024-1-ND; Order_Code_Farnell: 3019226RL; Order_Code_RS: N/A
C62 = MCD-00006: Capacitor, MLCC, 100nF, 16V, X7R, 10%, 0402, T=0.5mm; Manufacturer_Part_Number: CC0402KRX7R7BB104; Manufacturer: YAGEO; Alternate_Manufacturer_Part_Number: GCM155R71C104KA55D; Alternate_Manufacturer: MURATA; Provided_By: SUBCO; Internal_Part_Number: MCD-00006; ComponentLink1Description: Datasheet; Status: Released; Package: C0402; Part_Type: Capacitor; ComponentLink1URL: http://tunmcdsvn.tun.st.com/Component_Datasheet_Library/Trunk/Capacitors/Yageo_Multilayer_Capacitor_X7R_series_100pF_to_22uF
CN9 = MCD-03232: USB_TypeC, 24 pins, RA, SMD, T=2.96mm; Part_Type: Connector; Part_Preference: Recommended; Manufacturer: AMPHENOL ICC; Manufacturer_Part_Number: 12401826E412A; Component_Country_Of_Origin: China°; ShowFields: YES; ID: 5348; Internal_Part_Number: MCD-03232; Status: Released; ComponentLink1URL: http://tunmcdsvn.tun.st.com/Component_Documentation_Library/Trunk/Connector/AMPHEMOL_ICC_12401826E412A; Order_Code_Digikey: 12401826E412ATR-ND; Order_Code_Farnell: 3727763; Order_Code_RS: N/A
LD1 = MCD-00584: LED Blue, 0603 SMD, 3.3 V Forward Voltage; Part_Type: Display; Manufacturer_Part_Number: VLMB1300-GS08; Manufacturer: VISHAY; Part_Preference: Recommended; Order_Code_RS: 7730430; Component_Country_Of_Origin: China; Internal_Part_Number: MCD-00584; Status: Released; Package: LED 0603; ComponentLink1URL: http://tunmcdsvn.tun.st.com/Component_Datasheet_Library/Trunk/Display/VISHAY_LED_BLUE_VLMB1300-GS08; Order_Code_Digikey: VLMB1300-GS08CT-ND; Order_Code_Farnell: 2251459
LD2 = MCD-00589: LED Green, 0603 SMD, Fw Voltage = 2.8V - 3.6V; Part_Type: Display; Manufacturer_Part_Number: VLMTG1300-GS08; Manufacturer: VISHAY; Part_Preference: Recommended; Order_Code_RS: 7730452; Component_Country_Of_Origin: China; Internal_Part_Number: MCD-00589; Status: Released; Package: LED 0603; ComponentLink1URL: http://tunmcdsvn.tun.st.com/Component_Datasheet_Library/Trunk/Display/VISHAY_LED_GREEN_VLMTG1300-GS08; Order_Code_Digikey: VLMTG1300-GS08CT-ND; Order_Code_Farnell: 2251490
LD3 = MCD-00587: LED Red, 0603 SMD, 2V Forward Voltage; Part_Type: Display; Manufacturer_Part_Number: VLMS1300-GS08; Manufacturer: VISHAY; Part_Preference: Recommended; Alternate_Internal_Part_Number: MCD-02401; Component_Country_Of_Origin: China; Internal_Part_Number: MCD-00587; Status: Released; Package: LED 0603; ComponentLink1URL: http://tunmcdsvn.tun.st.com/Component_Datasheet_Library/Trunk/Display/VISHAY_LED_RED_VLMS1300-GS08; Order_Code_Digikey: VLMS1300-GS08CT-ND; Order_Code_Farnell: 2078728
R6-R8 = MCD-00507: Resistor, 680R, 0402, +/-1%, 1/16W; Manufacturer_Part_Number: RC0402FR-07680RL; Manufacturer: YAGEO; Part_Preference: Recommended; Component_Country_Of_Origin: China; Internal_Part_Number: MCD-00507; Status: Released; Part_Type: Resistor; Package: 0402; ComponentLink1URL: http://tunmcdsvn.tun.st.com/Component_Documentation_Library/Trunk/Resistor/YAGEO_RC_L_Series; Order_Code_Digikey: 311-680LRCT-ND; Order_Code_Farnell: 9239219; Order_Code_RS: N/A
R11 R12 = MCD-00333: Resistor, 5K1, 0402, +/-1%, 1/16W; Manufacturer_Part_Number: RC0402FR-075K1L; Manufacturer: YAGEO; Part_Preference: Recommended; Component_Country_Of_Origin: China; Internal_Part_Number: MCD-00333; Status: Released; Part_Type: Resistor; Package: 0402; ComponentLink1URL: http://tunmcdsvn.tun.st.com/Component_Documentation_Library/Trunk/Resistor/YAGEO_RC_L_Series; Order_Code_Digikey: 311-5.10KLRCT-ND; Order_Code_Farnell: 1458805; Order_Code_RS: N/A
SB18 SB19 = MCD-01618: as SB1 on sheet Extension_CN; Internal_Part_Number: MCD-01618; Status: Released; Package: SB0402; ComponentLink1URL: http://tunmcdsvn.tun.st.com/Component_Datasheet_Library/Trunk/Resistors/Yageo_Resistor_RC0402-series; Order_Code_Digikey: 311-0.0JRTR-ND; Order_Code_Farnell: 2363467
U1 = MCD-00649: Common mode filter with ESD protection for USB 2.0 interface; Part_Type: Diode; Manufacturer: STMICROELECTRONICS; BMS_Part_Number: 9151138; Part_Preference: Recommended; Manufacturer_HQ_COO: EU; Component_Country_Of_Origin: China; Internal_Part_Number: MCD-00649; Value: ECMF02-2AMX6; Status: Released; Manufacturer_Part_Number: ECMF02-2AMX6; ComponentLink1URL: http://tunmcdsvn.tun.st.com/Component_Datasheet_Library/Trunk/Diodes/STM_ESD_ECMF02-2AMX6
U2 = MCD-01207: High power Transient voltage suppressor:25V/35A EOS and ESD transients protection.; Part_Type: Diode; Manufacturer: STMICROELECTRONICS; BMS_Part_Number: 9179045; Part_Preference: Recommended; Manufacturer_HQ_COO: EU; Component_Country_Of_Origin: China; Internal_Part_Number: MCD-01207; Status: Released; Manufacturer_Part_Number: ESDA25P35-1U1M; ComponentLink1URL: http://tunmcdsvn.tun.st.com/Component_Datasheet_Library/Trunk/Diodes/STM_ESD_ESDA25P35-1U1M; Package: QFN1610
U16-U19 = MCD-00170: ESD protection 6V1; BMS_Part_Number: 9151132; Part_Type: Diode; Part_Preference: Recommended; Manufacturer: STMICROELECTRONICS; Manufacturer_HQ_COO: EU; Component_Country_Of_Origin: China; ShowFields: YES; ID: 2696; Internal_Part_Number: MCD-00170; Status: Released; Manufacturer_Part_Number: ESDALC6V1-1U2; ComponentLink1URL: http://tunmcdsvn.tun.st.com/Component_Documentation_Library/Trunk/Diode/STMICROELECTRONICS_ESDALC6V1-1U2; Order_Code_Digikey: N/A; Order_Code_Farnell: N/A; Order_Code_RS: N/A

## Sheet Power_Management.SchDoc: Power Management
size A4; Date: Not used; ApprovedBy: Not used; CheckedBy: Not used; Author: Not used; CompanyName: STMicroelectronics; DrawnBy: Not used; Engineer: Not used; Organization: Not used; Address1: Not used; Address2: Not used; Address3: Not used; Address4: Not used; DocumentNumber: Not used; Revision: Not used; SheetNumber: 5; SheetTotal: 7; CurrentTime: Not used; CurrentDate: Not used; Time: Not used; DocumentFullPathAndName: Not used; DocumentName: Not used; ModifiedDate: Not used; ImagePath: Not used; ProjectName: Not used; Application_BuildNumber: Not used
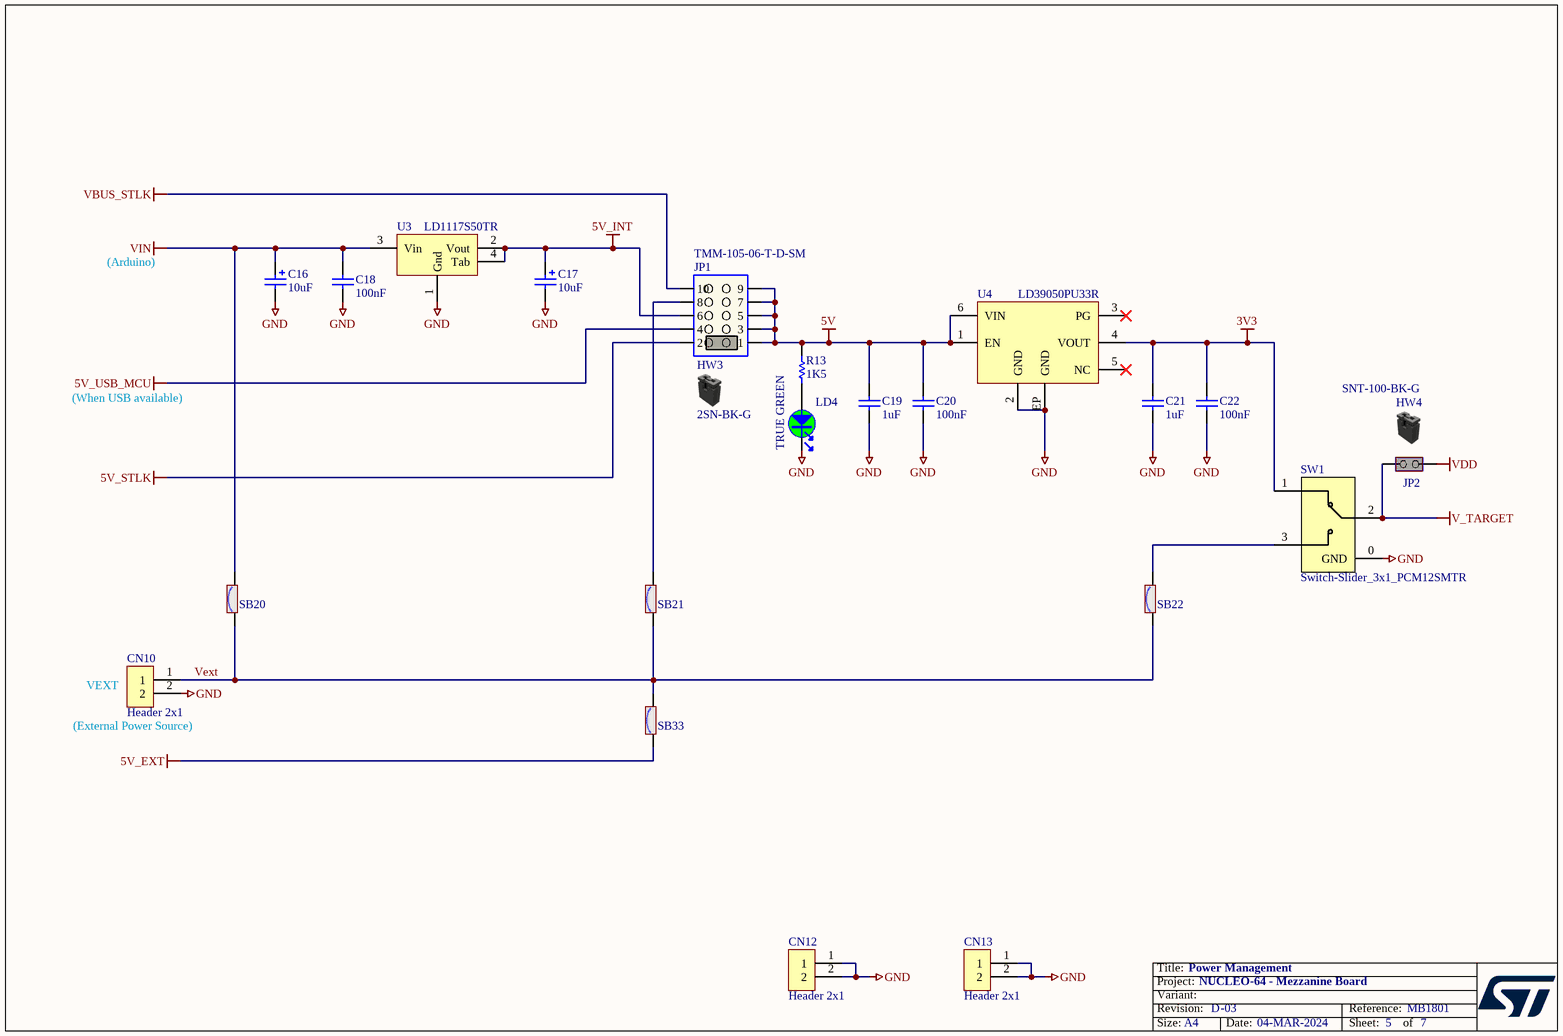
[diagram p4: Power_Management.SchDoc]

### Parts
C16  value 10uF  [CPOL_TAJ-B_1210_H210]  (hidden comment: Cap_POL_TANA)
C17  value 10uF  [CPOL_TAJ-B_1210_H210]  (hidden comment: Cap_POL_TANA)
C18  value 100nF  [C0402]  (hidden comment: Capacitor)
C19  value 1uF  [C0805_H0P85]  (hidden comment: Capacitor)
C20  value 100nF  [C0402]  (hidden comment: Capacitor)
C21  value 1uF  [C0805_H0P85]  (hidden comment: Capacitor)
C22  value 100nF  [C0402]  (hidden comment: Capacitor)
CN10  Header 2x1  [CON_SAMTEC_TSW-102-07-G-S]
CN12  Header 2x1  [CON_SAMTEC_TSW-102-07-G-S]
CN13  Header 2x1  [CON_SAMTEC_TSW-102-07-G-S]
HW3  2SN-BK-G  (mechanical)
HW4  value SNT-100-BK-G  (hidden comment: Shunt Black 2.54mm)  (mechanical)
JP1  value TMM-105-06-T-D-SM  [CON_SAMTEC_TMM-105-06-T-D-SM]  (hidden comment: Jumper 5 Positions)
JP2  Jumper_Header 2x1 Fitted  [CON_SAMTEC_TSW-102-07-G-S]  (value not drawn)
LD4  value TRUE GREEN  [LED_0603_VISHAY_VLMTG1300-GS08_GREEN_1A2K_H0P8]  (hidden comment: LED_green)
R13  value 1K5  [R0402]  (hidden comment: Resistor)
SB20  SB_ON  [SOLDER-BRIDGE_R0402-0R]  (value not drawn)
SB21  SB_ON  [SOLDER-BRIDGE_R0402-0R]  (value not drawn)
SB22  SB_ON  [SOLDER-BRIDGE_R0402-0R]  (value not drawn)
SB33  SB_ON  [SOLDER-BRIDGE_R0402-0R]  (value not drawn)
SW1  value Switch-Slider_3x1_PCM12SMTR  [SWI_SPDT-RA_TE-CONNECTIVITY_MLL1200S_1P2T]  (hidden comment: SW_MECA)
U3  LD1117S50TR  [REG_SOT223-TAB]
U4  LD39050PU33R  [ICC_DFN6-EPAD_3X3_P095]

### Nets
3V3: C21.2 C22.2 SW1.1 U4.4(VOUT)
5V: C19.2 C20.2 JP1.1 JP1.3 JP1.5 JP1.7 JP1.9 R13.2 U4.1(EN) U4.6(VIN)
5V_EXT: SB33.1
5V_INT: C17.1 JP1.6 U3.2(Vout) U3.4(Tab)
5V_STLK: JP1.2
5V_USB_MCU: JP1.4
GND: C16.2 C17.2 C18.1 C19.1 C20.1 C21.1 C22.1 CN10.2 CN12.1 CN12.2 CN13.1 CN13.2 LD4.2 SW1.0(GND) U3.1(Gnd) U4.2(GND) U4.EP(GND)
V_TARGET: JP2.1(COMMON) SW1.2
VBUS_STLK: JP1.10
VDD: JP2.2(NO)
VIN: C16.1 C18.2 SB20.2 U3.3(Vin)
Vext: CN10.1 SB20.1 SB21.1 SB22.1 SB33.2
NetJP1_8: JP1.8 SB21.2
NetLD4_1: LD4.1 R13.1
NetSB22_2: SB22.2 SW1.3

Not connected (* = marked no-connect by the designer): U4 3(PG)* 5(NC)*

### Notes on the sheet
- (Arduino)
- (When USB available)
- (near CN10) VEXT
- (near CN10) (External Power Source)
- Title:
- Project:
- Size:
- Revision:
- Variant:
- A4
- -
- Date:
- Reference:
- Sheet:
- of

### Library data of the parts
C16 C17 = MCD-00324: Capacitor, Tantalum, 10uF, 25V, 2R5, +/-10%, Type_B (3528 metric), T=1.9mm; Manufacturer_Part_Number: TAJB106K025RNJ; Manufacturer: AVX; Part_Preference: Recommended; Order_Code_RS: 136-0159; Component_Country_Of_Origin: El Salvador; Revision: July-2002: Re-released for DXP Platform.; Internal_Part_Number: MCD-00324; Status: Released; Part_Type: Capacitor; Package: 3528 (metric); ComponentLink1URL: http://tunmcdsvn.tun.st.com/Component_Documentation_Library/Trunk/Capacitor/AVX_TAJ_Series; Order_Code_Digikey: 478-5257-1-ND; Order_Code_Farnell: 2333024
C18 C20 C22 = MCD-02355: as C7 on sheet Extension_CN; Internal_Part_Number: MCD-02355; Status: Checked; Part_Type: Capacitor; Package: 0402; ComponentLink1URL: http://tunmcdsvn.tun.st.com/Component_Documentation_Library/Trunk/Capacitor/WALSIN_Monolithic_Series/; Order_Code_Digikey: 1292-1175-1-ND; Order_Code_Farnell: 2496772
C19 C21 = MCD-01550: as C1 on sheet Extension_CN; Internal_Part_Number: MCD-01550; Status: Released; Part_Type: Capacitor; Package: 0805; ComponentLink1URL: http://tunmcdsvn.tun.st.com/Component_Documentation_Library/Trunk/Capacitor/YAGEO_X5R_Series; Order_Code_Digikey: 311-3427-1-ND; Order_Code_Farnell: N/A; Order_Code_RS: N/A
CN10 CN12 CN13 = MCD-00032: as CN11 on sheet Extension_CN; Internal_Part_Number: MCD-00032; Value: Header 2x1; Status: Released; ComponentLink1URL: http://tunmcdsvn.tun.st.com/Component_Documentation_Library/Trunk/Connector/SAMTEC_TSW_Series/; Order_Code_Digikey: SAM1029-02-ND; Order_Code_Farnell: 2505044
HW3 = MCD-03319: Shunt, 2,00mm, black; Part_Type: Connector; Part_Preference: Recommended; Manufacturer: SAMTEC; Full_Alternate_Internal_Part_Number: CHERNG-WEEI_CMJ-20AB; Order_code_RS: 159-3178; ShowFields: YES; ID: 5435; Value: 2SN-BK-G; Order_code_Digikey: SAM8748-ND; Order_code_Farnell: 2751489; Status: New; ComponentLink1URL: http://tunmcdsvn.tun.st.com/Component_Documentation_Library/Trunk; Internal_Part_Number: MCD-03319; Manufacturer_Part_Number: 2SN-BK-G; Package: N/A
HW4 = MCD-00043: SHUNT 2.54mm BLACK; Part_Type: Misc; Manufacturer: SAMTEC; Part_Preference: Recommended; Alternate_Internal_Part_Number: MCD-02388; Component_Country_Of_Origin: China, Costa Rica, Malaysia, United States, Vietnam; Internal_Part_Number: MCD-00043; Status: Released; Manufacturer_Part_Number: SNT-100-BK-G; ComponentLink1URL: http://tunmcdsvn.tun.st.com/Component_Datasheet_Library/Trunk/Connectors/Samtec_Shunt_Jumper_SNT100
JP1 = MCD-03317: Header, 10x2, 2,00mm, h=7,04mm, VR, SMD; Part_Type: Connector; Part_Preference: Recommended; Manufacturer: SAMTEC; Full_Alternate_Internal_Part_Number: CHERNG-WEEI_P401-MG4GN-0404-10-R; ShowFields: YES; ID: 5433; Internal_Part_Number: MCD-03317; Status: New; Manufacturer_Part_Number: TMM-105-06-T-D-SM; Package: TMM-105-06-T-D-SM; ComponentLink1URL: http://tunmcdsvn.tun.st.com/Component_Documentation_Library/Trunk/Connector/SAMTEC_TMMH(SMD)_Series; Order_Code_Digikey: TMM-105-06-T-D-SM-A-ND; Order_Code_Farnell: 3662156; Order_Code_RS: N/A
JP2 = MCD-01904: Header, 2x1, 2.54mm, VR, TH, T=5.84mm/2.54mm; Part_Type: Connector; Manufacturer_Part_Number: TSW-102-07-G-S; Manufacturer: SAMTEC; Part_Preference: Recommended; Order_Code_RS: 155-7981; Component_Country_Of_Origin: China, Costa Rica, Malaysia, United States, Vietnam; Internal_Part_Number: MCD-01904; Value: Header 2x1; Status: Checked; ComponentLink1URL: http://tunmcdsvn.tun.st.com/Component_Documentation_Library/Trunk/Connector/SAMTEC_TSW_Series/; Order_Code_Digikey: SAM1029-02-ND; Order_Code_Farnell: 2505044
LD4 = MCD-00589: as LD2 on sheet Accessories; Internal_Part_Number: MCD-00589; Status: Released; Package: LED 0603; ComponentLink1URL: http://tunmcdsvn.tun.st.com/Component_Datasheet_Library/Trunk/Display/VISHAY_LED_GREEN_VLMTG1300-GS08; Order_Code_Digikey: VLMTG1300-GS08CT-ND; Order_Code_Farnell: 2251490
R13 = MCD-00068: Resistor, 1K5, 0402, +/-1%, 1/16W; Part_Preference: Recommended; Manufacturer: YAGEO; Manufacturer_Part_Number: RC0402FR-071K5L; Component_Country_Of_Origin: China; ShowFields: YES; ID: 2524; Internal_Part_Number: MCD-00068; Status: Released; Part_Type: Resistor; Package: 0402; ComponentLink1URL: http://tunmcdsvn.tun.st.com/Component_Documentation_Library/Trunk/Resistor/YAGEO_RC_L_Series; Order_Code_Digikey: 311-1.50KLRCT-ND; Order_Code_Farnell: 9239251; Order_Code_RS: N/A
SB20-SB22 SB33 = MCD-01618: as SB1 on sheet Extension_CN; Internal_Part_Number: MCD-01618; Status: Released; Package: SB0402; ComponentLink1URL: http://tunmcdsvn.tun.st.com/Component_Datasheet_Library/Trunk/Resistors/Yageo_Resistor_RC0402-series; Order_Code_Digikey: 311-0.0JRTR-ND; Order_Code_Farnell: 2363467
SW1 = MCD-03571: Slide switch, 3x1, 1.5mm, RA, SMT, T=1.65mm; Part_Type: Connector; Part_Preference: Recommended; Manufacturer: C&K; Manufacturer_Part_Number: PCM12SMTR; Order_Code_RS: 793-1721; ShowFields: YES; ID: 5687; Internal_Part_Number: MCD-03571; Status: New; Package: NA; ComponentLink1URL: http://tunmcdsvn.tun.st.com/Component_Documentation_Library/Trunk/Connector/C&K_PCM12SMTR/; Order_Code_Digikey: 401-2016-2-ND; Order_Code_Farnell: 9575146
U3 = MCD-00088: IC REG LDO 5V 0.8A SOT223; Manufacturer: STMICROELECTRONICS; BMS_Part_Number: 9176133; Part_Preference: Recommended; Manufacturer_HQ_COO: EU; Component_Country_Of_Origin: China; Internal_Part_Number: MCD-00088; Value: LD1117S50TR; Status: Released; Part_Type: IC; Manufacturer_Part_Number: LD1117S50TR; Package: SOT-223; ComponentLink1URL: http://tunmcdsvn.tun.st.com/Component_Datasheet_Library/Trunk/IC/STM_LDO_LD1117
U4 = MCD-00215: Low quiescent current and low noise voltage regulators; Part_Type: IC; Manufacturer: STMICROELECTRONICS; BMS_Part_Number: 9176126; Part_Preference: Recommended; Manufacturer_HQ_COO: EU; Component_Country_Of_Origin: Malaysia; Internal_Part_Number: MCD-00215; Value: LD39050PU33R; Status: Released; Manufacturer_Part_Number: LD39050PU33R; Package: DFN6 3x3mm; ComponentLink1URL: http://tunmcdsvn.tun.st.com/Component_Datasheet_Library/Trunk/IC/STM_LDO_LD39050PU